# EAGLE design stm32_nrf (EAGLE 7.6.0)
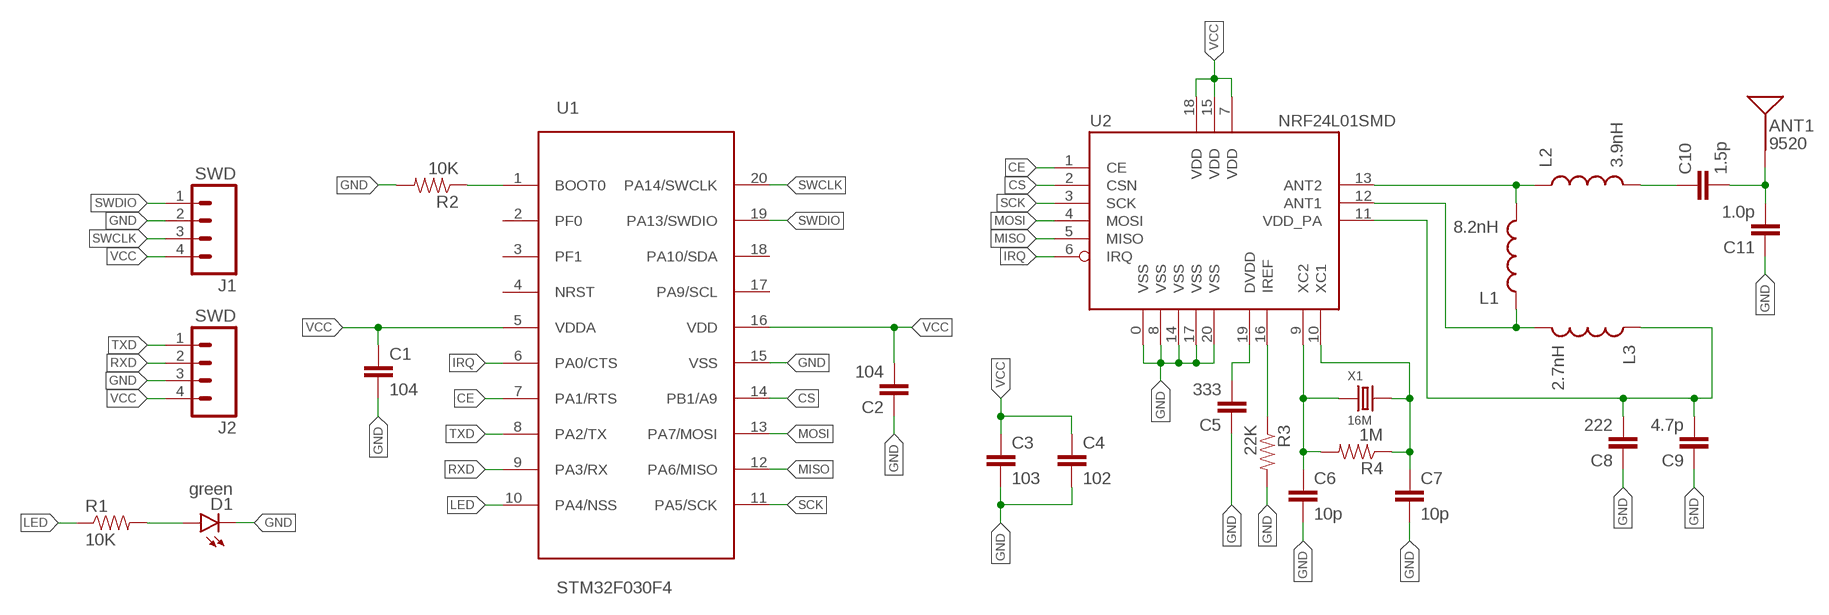
[diagram p0: schematic, sheet 1]

## Parts
ANT1  9520  ANTENNA2.4GHZ-9.5X2.0MM  [ANT-2.4GHZ-9.5X2.0MM]
C1  104  CAP0402-CAP  [0402-CAP]
C2  104  CAP0402-CAP  [0402-CAP]
C3  103  CAP0402-CAP  [0402-CAP]
C4  102  CAP0402-CAP  [0402-CAP]
C5  333  CAP0402-CAP  [0402-CAP]
C6  10p  CAP0402-CAP  [0402-CAP]
C7  10p  CAP0402-CAP  [0402-CAP]
C8  222  CAP0402-CAP  [0402-CAP]
C9  4.7p  CAP0402-CAP  [0402-CAP]
C10  1.5p  CAP0402-CAP  [0402-CAP]
C11  1.0p  CAP0402-CAP  [0402-CAP]
D1  green  LED-EASY  [LED-0603-EASY]
J1  SWD  M041X04_NO_SILK  [1X04_NO_SILK]
J2  SWD  M041X04_NO_SILK  [1X04_NO_SILK]
L1  8.2nH  INDUCTOR0402  [C0402]
L2  3.9nH  INDUCTOR0402  [C0402]
L3  2.7nH  INDUCTOR0402  [C0402]
R1  10K  RESISTOR0402  [0402-RES]
R2  10K  RESISTOR0402  [0402-RES]
R3  22K  RESISTOR0402  [0402-RES]
R4  1M  RESISTOR0402  [0402-RES]
U1  STM32F030F4  [TSSOP20]
U2  NRF24L01SMD  [QFN20]
X1  16M  CRYSTAL'3225'  [X4-SMD-3.2X2.5X0.7MM]

## Nets
CE: U1.7(PA1/RTS) U2.1(CE)
CS: U1.14(PB1/A9) U2.2(CSN)
DVDD: C5.2 U2.19(DVDD)
GND: C1.2 C2.1 C3.2 C4.2 C5.1 C6.2 C7.2 C8.1 C9.1 C11.1 D1.-(C) J1.2 J2.3 R2.2 R3.2 U1.15(VSS) U2.0(VSS) U2.8(VSS) U2.14(VSS) U2.17(VSS) U2.20(VSS)
IRQ: U1.6(PA0/CTS) U2.6(IRQ)
LED: R1.1 U1.10(PA4/NSS)
MISO: U1.12(PA6/MISO) U2.5(MISO)
MOSI: U1.13(PA7/MOSI) U2.4(MOSI)
N$1: C7.1 R4.1 U2.10(XC1) X1.3
N$2: C6.1 R4.2 U2.9(XC2) X1.1
N$3: L1.2 L2.1 U2.13(ANT2)
N$4: D1.+(A) R1.2
N$5: R2.1 U1.1(BOOT0)
N$6: C10.1 L2.2
N$7: ANT1.FEED(SIGNAL) C10.2 C11.2
N$8: L1.1 L3.2 U2.12(ANT1)
N$13: R3.1 U2.16(IREF)
RXD: J2.2 U1.9(PA3/RX)
SCK: U1.11(PA5/SCK) U2.3(SCK)
SWCLK: J1.3 U1.20(PA14/SWCLK)
SWDIO: J1.1 U1.19(PA13/SWDIO)
TXD: J2.1 U1.8(PA2/TX)
VCC: C1.1 C2.2 C3.1 C4.1 J1.4 J2.4 U1.5(VDDA) U1.16(VDD) U2.7(VDD) U2.15(VDD) U2.18(VDD)
VDD_PA: C8.2 C9.2 L3.1 U2.11(VDD_PA)
Unconnected: U1.2(PF0) U1.3(PF1) U1.4(NRST) U1.17(PA9/SCL) U1.18(PA10/SDA)

## Library data of the parts
ANT1 = SparkFun-RF:ANTENNA: Single-ended Antennae 2.4GHz and antennae with just one terminal. These are all chip antennae. 2.4GHz (WiFi/BT/ZigBee) Antennae ANT-2.4GHZ-6.5X2.2MM - 6.5 x 2.2 mm chip antenna. (SparkFun Product <https://www.sparkfun.com/products/144>) ANT-2.4GHZ8.0X1.0MM - 8.0 x 1.0 mm chip antenna. (Datasheet <http://www.mouser.com/ds/2/611/antenna_2500at44m0400-242425.pdf>) ANT-2.4GHZ9.5X2.0MM - 9.5 x 2.0 mm chip antenna. (SparkFun Product <https://www.sparkfun.com/products/9025>); PROD_ID: ANT-09067; SF_ID: WRL-09025
C1-C11 = xmgu2008:CAP: Capacitor Standard 0603 ceramic capacitor, and 0.1" leaded capacitor.
D1 = z_jlc_smt:LED: LEDs Standard schematic elements and footprints for 5mm, 3mm, 1206, and 0603 sized LEDs. 5mm - Spark Fun Electronics SKU : COM-00529 (and others)
J1 J2 = SparkFun-Connectors:M04: Header 4 Standard 4-pin 0.1" header. Use with straight break away headers (SKU : PRT-00116), right angle break away headers (PRT-00553), swiss pins (PRT-00743), machine pins (PRT-00117), and female headers (PRT-00115). Molex polarized connector foot print use with SKU : PRT-08231 with associated crimp pins and housings. 1MM SMD Version SKU: PRT-10208; PROD_ID: CONN-09696
L1-L3 = SparkFun-Passives:INDUCTOR: Inductors Basic Inductor/Choke - 0603 and 1206. Footprints are not proven and vary greatly between part numbers. INDUCTOR POWER 3.3UH 4.0A SMD 0.197" L x 0.197" W x 0.177" H (5.00mm x 5.00mm x 4.50mm)
R1-R4 = xmgu2008:RESISTOR: Resistor Basic schematic elements and footprints for 0603, 1206, and PTH resistors.
U1 = xmgu2008:STM32F030F4
U2 = SparkFun-RF:NRF24L01: 2.4GHz Low Power Transceiver This is the very popular, low cost, very low power RF transceiver from Nordic Semiconductor. Simple SPI interface. SKU: COM-00690
X1 = Seeed-OPL-Crystal-Oscillator:CRYSTAL

## Board
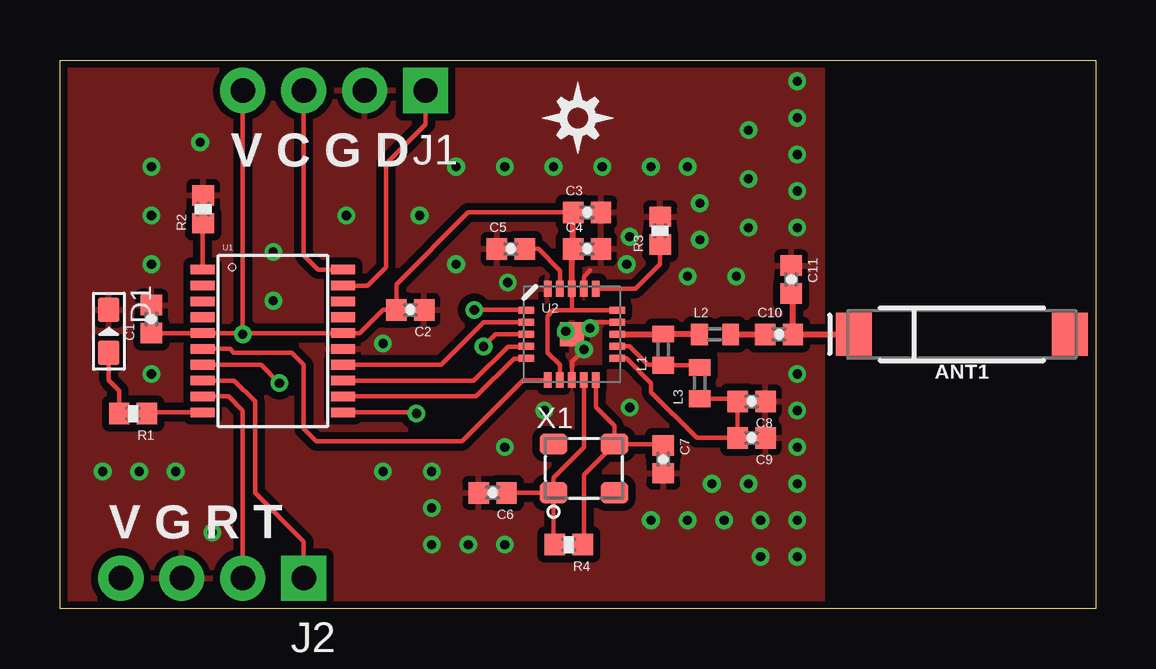
[diagram p1: board, top side]
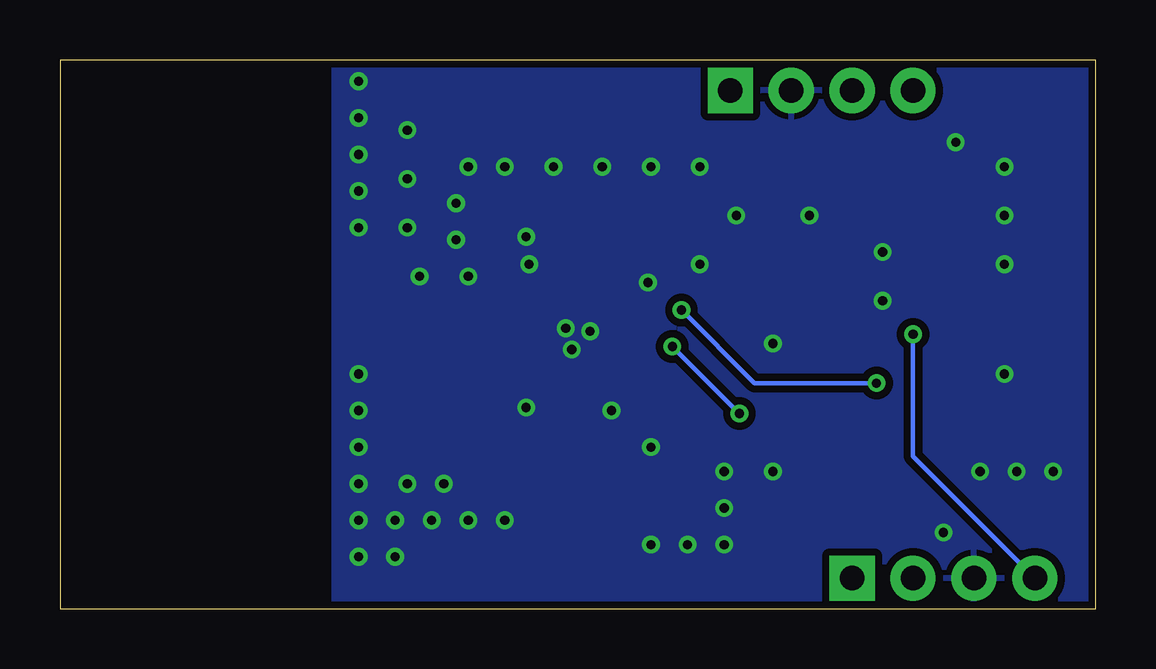
[diagram p2: board, bottom side, seen from below]

Size 43.18 x 22.86 mm. Coordinates in mm from the lower left corner, seen from the top.
Outline: 0,0 0,22.86 43.18,22.86 43.18,0 0,0
Copper layers (1*16): Top 0.035mm / dielectric 1.5mm / Bottom 0.035mm
Design rules "SparkFun-2-layer-TIGHT": minimum track width 7mil, minimum drill 15mil, track to track 7mil, track to pad 7mil, pad to pad 7mil, via to via 7mil, smd to smd 7mil, copper to edge 7mil, drill to drill 7mil, minimum pad ring 7mil, minimum via ring 7mil, stop-mask expansion 4mil, vias tented up to drill 20mil, thermal gap 10mil

### Footprints (pad centres in the part's own frame; a part is rotated, then mirrored left to right if it is on the bottom)
ANT-2.4GHZ-9.5X2.0MM = smd 1.8 x 1.5: FEED 0,4.5; NC 0,-4.5
0402-CAP = smd 0.85 x 0.9: 1 -0.58,0; 2 0.58,0
LED-0603-EASY = smd 1.016 x 0.889: + 0.889,0; - -0.889,0
1X04_NO_SILK = drill 1.016 pad 1.88 square: 1 0,0 | drill 1.016 pad 1.88: 2 2.54,0; 3 5.08,0; 4 7.62,0
C0402 = smd 0.7 x 0.9: 1 -0.65,0; 2 0.65,0
0402-RES = smd 0.85 x 0.9: 1 -0.58,0; 2 0.58,0
TSSOP20 = smd 1 x 0.4: 1 -2.937,2.693; 2 -2.937,2.032; 3 -2.937,1.372; 4 -2.937,0.712; 5 -2.937,0.051; 6 -2.937,-0.609; 7 -2.937,-1.27; 8 -2.943,-1.93; 9 -2.937,-2.59; 10 -2.937,-3.251; 11 2.905,-3.251; 12 2.905,-2.59; 13 2.911,-1.93; 14 2.905,-1.27; 15 2.905,-0.609; 16 2.905,0.051; 17 2.905,0.712; 18 2.905,1.372; 19 2.905,2.032; 20 2.905,2.693
QFN20 = smd 1 x 1: 0 0,0 | smd 0.65 x 0.3: 1 -1.9,1; 2 -1.9,0.5; 3 -1.9,0; 4 -1.9,-0.5; 5 -1.9,-1; 11 1.9,-1; 12 1.9,-0.5; 13 1.9,0; 14 1.9,0.5; 15 1.9,1 | smd 0.3 x 0.65: 6 -1,-1.9; 7 -0.5,-1.9; 8 0,-1.9; 9 0.5,-1.9; 10 1,-1.9; 16 1,1.9; 17 0.5,1.9; 18 0,1.9; 19 -0.5,1.9; 20 -1,1.9
X4-SMD-3.2X2.5X0.7MM = smd 1.143 x 0.889: 1 -1.27,-1.016; 2 1.27,-1.016; 3 1.27,1.016; 4 -1.27,1.016

### Placement (x,y rotation side)
ANT1  37.59,11.43 90 top
C1  3.81,12.07 90 top
C2  14.6,12.45 180 top
C3  21.97,16.51 0 top
C4  21.97,14.99 0 top
C5  18.8,14.99 0 top
C6  18.03,4.83 180 top
C7  25.15,6.22 270 top
C8  28.83,8.64 180 top
C9  28.83,7.11 180 top
C10  29.97,11.43 0 top
C11  30.48,13.72 270 top
D1  2.03,11.56 270 top
J1  15.24,21.59 180 top
J2  10.16,1.27 180 top
L1  25.15,10.8 90 top
L2  27.3,11.43 0 top
L3  26.67,9.4 90 top
R1  3.05,8.13 180 top
R2  5.97,16.64 90 top
R3  25.02,15.75 90 top
R4  21.21,2.67 180 top
U1  8.89,11.43 0 top
U2  21.34,11.43 0 top
U$1  [DIYNOVA_LOGO_SMALL]  20.07,18.92 0 top
X1  21.84,5.84 0 top

### Tracks (layer width: path | path; a pad name or v marks a point on that pad's centre or on a via)
CE  (via drill 0.38)
  Top 0.178: U1.7 8.38,10.16 v9.14,9.4 | U2.1 19.42,12.45 v17.27,12.45
  Bottom 0.178: v9.14,9.4 14.22,9.4 v17.27,12.45
CS
  Top 0.178: U2.2 19.43,11.94 17.65,11.94 15.87,10.16 U1.14 | U1.14
DVDD
  Top 0.178: U2.19 20.84,14.09 19.94,14.99 C5.2
GND  (via drill 0.38)
  Top 0.178: U2.17 21.84,13.84 22.1,14.1 | U2.14 22.34,11.93 v22.1,11.68 | U2.8 21.34,10.29 v21.84,10.8
  other vias: 21.08,11.56 18.67,13.59 23.75,15.49 23.62,14.35 23.75,8.38 20.19,8.25 30.73,15.88 30.73,17.4 30.73,18.92 30.73,20.45 30.73,21.97 30.73,9.78 30.73,8.25 30.73,6.73 30.73,5.21 30.73,3.68 30.73,2.16 29.21,3.68 27.69,3.68 26.16,3.68 24.64,3.68 28.7,5.21 27.18,5.21 29.21,2.16 18.54,2.67 17.02,2.67 15.49,2.67 15.49,4.19 15.49,5.72 18.54,6.73 4.83,5.72 6.35,3.17 3.3,5.72 1.78,5.72 3.81,9.78 8.89,12.83 8.89,14.86 11.94,16.38 14.99,16.38 16.51,14.35 13.46,11.05 3.81,14.35 3.81,16.38 3.81,18.41 5.84,19.43 24.64,18.41 26.16,18.41 26.67,16.89 26.67,15.37 26.16,13.84 28.19,13.84 28.7,15.88 28.7,17.91 28.7,19.94 22.61,18.41 20.57,18.41 18.54,18.41 16.51,18.41 13.46,5.72
  pour Bottom (isolate 0.305): 0,0 0,22.86 31.75,22.86 31.75,0
  pour Top (isolate 0.305): 0,0 0,22.86 31.75,22.86 31.75,0
IRQ
  Top 0.178: U2.6 19.3,9.52 16.76,6.99 10.67,6.99 10.16,7.49 10.16,10.16 9.65,10.67 7.24,10.67 7.09,10.82 U1.6
LED
  Top 0.178: U1.10 3.68,8.18 R1.1
MISO
  Top 0.178: U1.12 17.35,8.84 18.92,10.41 19.42,10.41 U2.5
MOSI
  Top 0.178: U1.13 17.25,9.5 18.67,10.92 19.43,10.92 U2.4
N$1
  Top 0.178: U2.10 22.34,8.4 23.11,7.62 X1.3 | X1.3 25.09,6.86 C7.1 | X1.3 21.84,5.59 21.84,2.72 R4.1
N$2
  Top 0.178: U2.9 21.84,6.72 20.57,5.46 X1.1 | X1.1 C6.1 | X1.1 20.57,2.72 R4.2
N$3
  Top 0.254: U2.13 25.13,11.43 L1.2 26.64,11.45 L2.1
N$4
  Top 0.178: R1.2 2.47,9.09 2.03,9.52 D1.+
N$5
  Top 0.178: U1.1 5.95,16.04 R2.1
N$6
  Top 0.254: L2.2 C10.1
N$7
  Top 0.254: ANT1.FEED C10.2 30.55,13.06 C11.2
N$8
  Top 0.178: U2.12 23.74,10.93 24.51,10.16 25.13,10.16 L1.1 26.57,10.14 L3.2
N$13
  Top 0.178: U2.16 24,13.33 25.02,14.35 R3.1
RXD
  Top 0.178: U1.9 7.03,8.84 7.62,8.25 J2.2
SCK  (via drill 0.38)
  Top 0.178: U1.11 14.81,8.18 v14.86,8.13 | U2.3 18.16,11.43 v17.65,10.92
  Bottom 0.178: v14.86,8.13 v17.65,10.92
SWCLK
  Top 0.178: U1.20 10.77,14.12 10.16,14.73 J1.3
SWDIO
  Top 0.178: U1.19 12.83,13.46 13.59,14.22 13.59,18.54 15.24,20.19 J1.1
TXD
  Top 0.178: U1.8 7.26,9.5 8.13,8.64 8.13,4.83 10.16,2.79 J2.1
VCC  (via drill 0.38)
  Top 0.178: U2.15 21.34,12.43 | 21.34,12.43 20.56,12.43 20.32,12.19 20.32,10.67 20.84,10.15 U2.7 | 21.34,12.43 U2.18 | C1.1 U1.5 7.57,11.48 v7.62,11.43 | J1.4 v7.62,11.43 | v7.62,11.43 7.67,11.48 U1.16 12.5,11.48 13.46,12.45 C2.2 14.03,13.52 17.02,16.51 C3.1
  Top 0.254: U2.18 21.34,14.93 C4.1 C3.1
  Bottom 0.178: v7.62,11.43 7.62,6.35 J2.4
VDD_PA
  Top 0.178: L3.1 28.14,8.75 C8.2 C9.2 26.54,7.11 24.64,9.02 24.64,9.4 23.61,10.43 U2.11

### Text on the board
tPlace: V C G D | V G R T